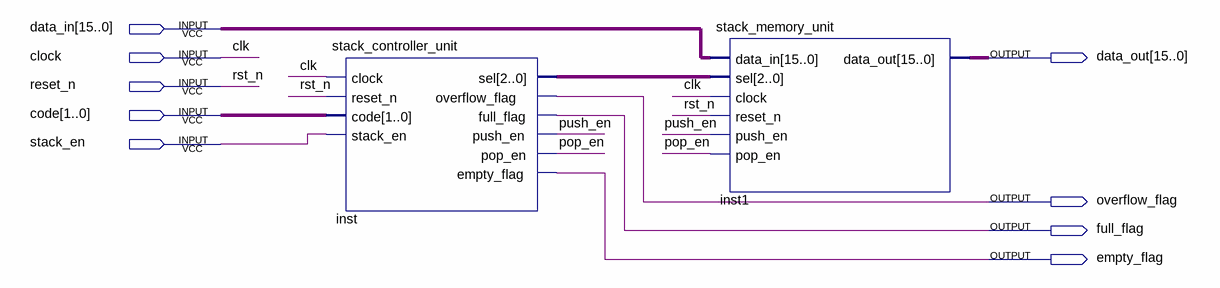
[diagram p0: schematic sheet]
// Quartus schematic stack_unit.bdf as structural Verilog: 2 symbols, 9 pins
module stack_unit (
  input  [15:0] data_in,
  input  clock,
  input  reset_n,
  input  [1:0] code,
  input  stack_en,
  output [15:0] data_out,
  output overflow_flag,
  output full_flag,
  output empty_flag
);

  wire pop_en, push_en;
  wire [2:0] inst_sel;

  stack_controller_unit inst (
    .clock(clock), .reset_n(reset_n), .code(code), .stack_en(stack_en), .sel(inst_sel),
    .overflow_flag(overflow_flag), .full_flag(full_flag), .push_en(push_en), .pop_en(pop_en),
    .empty_flag(empty_flag));
  stack_memory_unit inst1 (
    .data_in(data_in), .sel(inst_sel), .clock(clock), .reset_n(reset_n), .push_en(push_en), .pop_en(pop_en),
    .data_out(data_out));

  // Other names for the same wires on the sheet: clk = clock; rst_n = reset_n
endmodule
